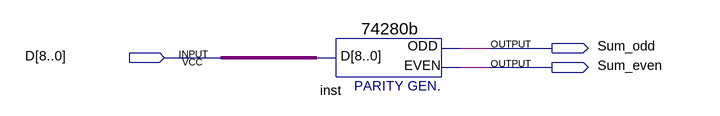
[diagram p0: schematic sheet]
// Quartus schematic ex6-8.bdf as structural Verilog: 1 symbols, 3 pins
module \ex6-8  (
  input  [8:0] D,
  output Sum_odd,
  output Sum_even
);

  \74280b  inst (.D(D), .ODD(Sum_odd), .EVEN(Sum_even));
endmodule
